# Altium project Teensy 3.2.PrjPcb
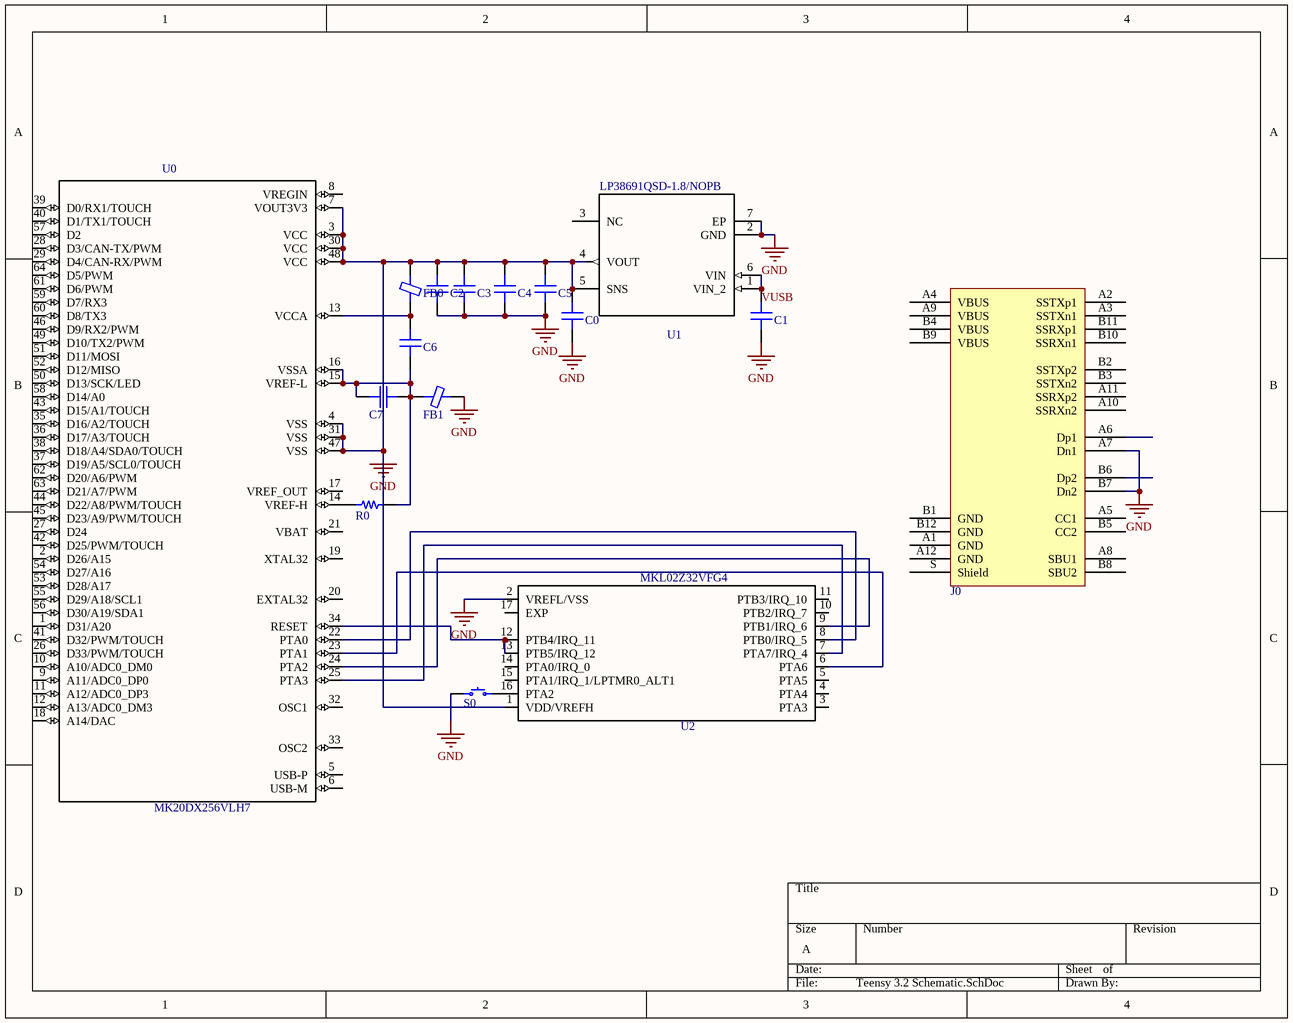
[diagram p0: Teensy 3.2 Schematic.SchDoc]
1 sheet, 16 parts. Net scope: global (net labels, ports and power ports of the same name join across sheets).

## Sheet Teensy 3.2 Schematic.SchDoc
size A

### Parts
C0  2.2uF  [CAP 0201/0603]  (value not drawn)
C1  2.2uF  [CAP 0201/0603]  (value not drawn)
C2  2.2uF  [CAP 0201/0603]  (value not drawn)
C3  0.1uF  [CAP 0402/1005]  (value not drawn)
C4  0.1uF  [CAP 0402/1005]  (value not drawn)
C5  0.1uF  [CAP 0402/1005]  (value not drawn)
C6  2.2uF  [CAP 0201/0603]  (value not drawn)
C7  0.1uF  [CAP 0402/1005]  (value not drawn)
FB0  600 Ohm @ 100MHz  [FER 0201/0603]  (value not drawn)
FB1  600 Ohm @ 100MHz  [FER 0201/0603]  (value not drawn)
J0  USB C  [TE USB-C 2129691-1]  (value not drawn)
R0  470  [RES 0402/1005]  (value not drawn)
S0  FSMSMTR  [TE FSMSMTR]  (value not drawn)
U0  MK20DX256VLH7  [QFP50P1200X1200X160-64N]
U1  LP38691QSD-1.8/NOPB  [DFN300X300X80-7N]
U2  MKL02Z32VFG4  [QFN50P300X300X65-17N]

### Nets
GND: C0.1 C0.2 C1.2 C2.1 C2.2 C3.1 C3.2 C4.1 C4.2 C5.1 C5.2 FB0.1 FB1.1 J0.A7(Dn1) J0.B7(Dn2) S0.1 U0.3(VCC) U0.4(VSS) U0.7(VOUT3V3) U0.30(VCC) U0.31(VSS) U0.47(VSS) U0.48(VCC) U1.2(GND) U1.4(VOUT) U1.5(SNS) U1.7(EP) U2.1(VDD/VREFH) U2.2(VREFL/VSS)
VUSB: C1.1 U1.1(VIN_2) U1.6(VIN)
NetC6_1: C6.1 FB0.2 U0.13(VCCA)
NetC6_2: C6.2 C7.1 C7.2 FB1.2 R0.1 U0.15(VREF-L) U0.16(VSSA)
NetR0_2: R0.2 U0.14(VREF-H)
NetS0_2: S0.2 U2.16(PTA2)
NetU0_22: U0.22(PTA0) U2.8(PTB0/IRQ_5)
NetU0_23: U0.23(PTA1) U2.6(PTA6)
NetU0_24: U0.24(PTA2) U2.9(PTB1/IRQ_6)
NetU0_25: U0.25(PTA3) U2.7(PTA7/IRQ_4)
NetU0_34: U0.34(RESET) U2.12(PTB4/IRQ_11) U2.13(PTB5/IRQ_12)

Not connected (* = marked no-connect by the designer): J0 A1(GND) A2(SSTXp1) A3(SSTXn1) A4(VBUS) A5(CC1) A6(Dp1) A8(SBU1) A9(VBUS) A10(SSRXn2) A11(SSRXp2) A12(GND) B1(GND) B2(SSTXp2) B3(SSTXn2) B4(VBUS) B5(CC2) B6(Dp2) B8(SBU2) B9(VBUS) B10(SSRXn1) B11(SSRXp1) B12(GND) S(Shield); U0 1(D31/A20) 2(D26/A15) 5(USB-P) 6(USB-M) 8(VREGIN) 9(A11/ADC0_DP0) 10(A10/ADC0_DM0) 11(A12/ADC0_DP3) 12(A13/ADC0_DM3) 17(VREF_OUT) 18(A14/DAC) 19(XTAL32) 20(EXTAL32) 21(VBAT) 26(D33/PWM/TOUCH) 27(D24) 28(D3/CAN-TX/PWM) 29(D4/CAN-RX/PWM) 32(OSC1) 33(OSC2) 35(D16/A2/TOUCH) 36(D17/A3/TOUCH) 37(D19/A5/SCL0/TOUCH) 38(D18/A4/SDA0/TOUCH) 39(D0/RX1/TOUCH) 40(D1/TX1/TOUCH) 41(D32/PWM/TOUCH) 42(D25/PWM/TOUCH) 43(D15/A1/TOUCH) 44(D22/A8/PWM/TOUCH) 45(D23/A9/PWM/TOUCH) 46(D9/RX2/PWM) 49(D10/TX2/PWM) 50(D13/SCK/LED) 51(D11/MOSI) 52(D12/MISO) 53(D28/A17) 54(D27/A16) 55(D29/A18/SCL1) 56(D30/A19/SDA1) 57(D2) 58(D14/A0) 59(D7/RX3) 60(D8/TX3) 61(D6/PWM) 62(D20/A6/PWM) 63(D21/A7/PWM) 64(D5/PWM); U1 3(NC); U2 3(PTA3) 4(PTA4) 5(PTA5) 10(PTB2/IRQ_7) 11(PTB3/IRQ_10) 14(PTA0/IRQ_0) 15(PTA1/IRQ_1/LPTMR0_ALT1) 17(EXP)

### Library data of the parts
C0-C2 C6 = GRM033R61A225KE47D: CAP CER 2.2UF 10V X5R 0201; Manufacturer: Murata Electronics North America; TemperatureRange: -55C ~ 85C; Tolerance: 10%; Value: 2.2uF; PartId: 30183; Part Number: GRM033R61A225KE47D; Supplier 1: Digi-Key; Supplier Part Number 1: 490-13227-2-ND; ComponentLink1Description: Datasheet; ComponentLink1URL: https://www.murata.com/~/media/webrenewal/support/library/catalog/products/capacitor/mlcc/c02e.ashx; ComponentLink2Description: Digi-Key Listing; ComponentLink2URL: https://www.digikey.com/product-detail/en/murata-electronics-north-america/GRM033R61A225KE47D/490-13227-2-ND/5877390; TemperatureCoefficient: X5R; Voltage: 10V; Price: 0; Device Package: 0201 (0603 Metric)
C3-C5 C7 = GRM155R70J104KA01D: CAP CER 0.1UF 6.3V X7R 0402; Manufacturer: Murata Electronics North America; TemperatureRange: -55C ~ 125C; Tolerance: 10%; Value: 0.1uF; PartId: 4880; Part Number: GRM155R70J104KA01D; Supplier 1: Digi-Key; Supplier Part Number 1: 490-6319-2-ND; ComponentLink1Description: Datasheet; ComponentLink1URL: http://www.murata.com/~/media/webrenewal/support/library/catalog/products/capacitor/mlcc/c02e.ashx; ComponentLink2Description: Digi-Key listing; ComponentLink2URL: http://digikey.com/product-detail/en/GRM155R70J104KA01D/490-6319-2-ND/2610876; TemperatureCoefficient: X7R; Voltage: 6.3V; Price: 0.006; Type: -; Device Package: 0402 (1005 Metric)
FB0 FB1 = BLM03AX601SN1D: FERRITE BEAD 600 OHM 0201 1LN; Manufacturer: Murata Electronics North America; DC Resistance: 850 mOhm; Current Rating: 250mA; PartId: 20358; Value: 600 Ohm @ 100MHz; Part Number: BLM03AX601SN1D; Supplier 1: Digi-Key; Supplier Part Number 1: 490-5624-2-ND; ComponentLink1Description: Datasheet; ComponentLink1URL: http://search.murata.co.jp/Ceramy/image/img/PDF/ENG/L0110S0100BLM03AX.pdf; ComponentLink2Description: Digi-Key Listing; ComponentLink2URL: https://www.digikey.com/product-detail/en/murata-electronics-north-america/BLM03AX601SN1D/490-5624-2-ND/2485955; Price: 0.0395; Device Package: 0201 (0603 Metric)
J0 = 2129691-1: USB 3.1 TYPE C MID MOUNT HYBRID; Manufacturer: TE Connectivity AMP Connectors; Number Of Positions: 24; Part Number: 2129691-1; PartId: 7863; Supplier 1: Digi-Key; Supplier Part Number 1: A122008TR-ND; ComponentLink1Description: Datasheet; ComponentLink1URL: http://media.digikey.com/pdf/Data%20Sheets/Tyco%20Electonics%20AMP%20PDFs/2129691_Dwg.pdf; ComponentLink2Description: Digi-Key Listing; ComponentLink2URL: http://www.digikey.ca/product-detail/en/2129691-1/A122008TR-ND/5401336; Price: 2.2088; Type: USB - C; Series: USB 3.1, Superspeed+
R0 = ERJ-2RKF4700X: RES SMD 470 OHM 1% 1/10W 0402; Manufacturer: Panasonic Electronic Components; TemperatureRange: -55C ~ 155C; TemperatureCoefficient: 100ppm/C; PowerRating: 0.1W, 1/10W; Value: 470; PartId: 176; Part Number: ERJ-2RKF4700X; Supplier 1: Digi-Key; Supplier Part Number 1: P470LTR-ND; ComponentLink1Description: Datasheet; ComponentLink1URL: http://industrial.panasonic.com/www-cgi/jvcr13pz.cgi?E+PZ+3+AOA0002+ERJ2RKF4700X+7+WW; ComponentLink2Description: Digikey listing; ComponentLink2URL: http://digikey.com/product-detail/en/ERJ-2RKF4700X/P470LTR-ND/1746229; Tolerance: 1%; Price: 0.0043; Type: Thick Film; Device Package: 0402 (1005 Metric)
S0 = FSMSMTR: SWITCH TACTILE SPST-NO 0.05A 24V; Manufacturer: TE Connectivity Alcoswitch Switches; Switch Function: Off-Mom; Contact Rating @ Voltage: 0.05A @ 24VDC; Actuator Type: Standard; Actuator Orientation: Top Actuated; Illumination: Non-Illuminated; Operating Force: 180gf; Switch Travel: 0.25mm; Mechanical Life: 20,000 Cycles; Part Number: FSMSMTR; PartId: 8251; Supplier 1: Digi-Key; Supplier Part Number 1: 450-1758-2-ND; ComponentLink1Description: Datasheet; ComponentLink1URL: http://www.te.com/commerce/DocumentDelivery/DDEController?Action=srchrtrv&DocNm=1437566-3&DocType=Customer+Drawing&DocLang=English; ComponentLink2Description: Digi-Key Listing; ComponentLink2URL: http://www.digikey.com/product-detail/en/FSMSMTR/450-1758-2-ND/529671; Price: 0.175; Circuit: SPST-NO; Illumination Voltage: -; Illumination Type, Colour: -; Operating Temperature: -35C ~ 85C
U0 = MK20DX256VLH7: MCU 32-bit Kinetis K20 ARM Cortex M4 RISC 256KB Flash 1.8V/2.5V/3.3V 64-Pin LQFP Tray; MF: NXP USA; MP: MK20DX256VLH7; Price: None; Package: LQFP-64 Freescale Semiconductor; Availability: Unavailable; SnapEDA_Link: https://www.snapeda.com/parts/MK20DX256VLH7/NXP%20USA%20Inc./view-part/?ref=snap; Value: *
U1 = LP38691QSD-1.8/NOPB: 500mA Low Dropout CMOS Linear egulators Stable with Ceramic Output Capacitors 6-WSON -40 to 125; MF: Texas Instruments; MP: LP38691QSD-1.8/NOPB; Availability: Unavailable; Package: WDFN-6 Texas Instruments; Price: None; SnapEDA_Link: https://www.snapeda.com/parts/LP38691QSD-1.8/NOPB/Texas%20Instruments/view-part/?ref=snap; Value: *
U2 = MKL02Z32VFG4: MCU 32-Bit KL02 ARM Cortex M0+ RISC 32KB Flash 1.8V/2.5V/3.3V 16-Pin QFN EP Tray; MF: NXP USA; Availability: Unavailable; SnapEDA_Link: https://www.snapeda.com/parts/MKL02Z32VFG4/NXP%20USA%20Inc./view-part/?ref=snap; Price: None; Package: QFN-16 Freescale Semiconductor; MP: MKL02Z32VFG4; Value: *